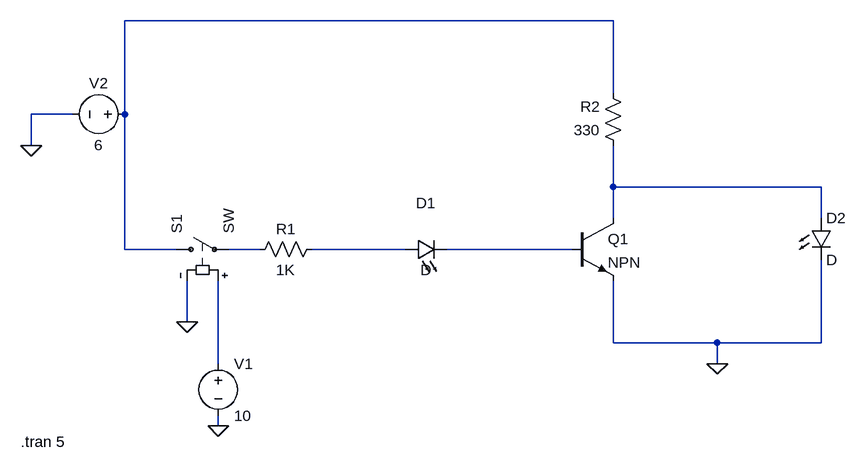
[diagram p0: schematic NOT Gate.asc]
NOT Gate.asc, the LTspice schematic file:
Version 4
SHEET 1 940 680
WIRE 560 -96 -192 -96
WIRE 560 16 560 -96
WIRE -272 48 -336 48
WIRE -192 48 -192 -96
WIRE -336 96 -336 48
WIRE 560 160 560 96
WIRE 880 160 560 160
WIRE 560 208 560 160
WIRE 880 208 880 160
WIRE -192 256 -192 48
WIRE -112 256 -192 256
WIRE 16 256 -32 256
WIRE 240 256 96 256
WIRE 496 256 304 256
WIRE -96 368 -96 304
WIRE 560 400 560 304
WIRE 720 400 560 400
WIRE 880 400 880 272
WIRE 880 400 720 400
WIRE -48 432 -48 304
WIRE 720 432 720 400
WIRE -48 528 -48 512
FLAG 720 432 0
FLAG -96 368 0
FLAG -48 528 0
FLAG -336 96 0
SYMBOL res 112 240 R90
WINDOW 0 0 56 VBottom 2
WINDOW 3 32 56 VTop 2
SYMATTR InstName R1
SYMATTR Value 1K
SYMATTR SpiceLine tol=1 pwr=0.1
SYMBOL res 576 112 R180
WINDOW 0 36 76 Left 2
WINDOW 3 36 40 Left 2
SYMATTR InstName R2
SYMATTR Value 330
SYMBOL npn 496 208 R0
SYMATTR InstName Q1
SYMBOL LED 240 272 R270
WINDOW 0 72 32 VTop 2
WINDOW 3 0 32 VBottom 2
SYMATTR InstName D1
SYMBOL LED 864 208 R0
SYMATTR InstName D2
SYMBOL sw -128 256 R270
SYMATTR InstName S1
SYMBOL voltage -48 416 R0
WINDOW 123 0 0 Left 0
WINDOW 39 0 0 Left 0
SYMATTR InstName V1
SYMATTR Value 10
SYMBOL voltage -176 48 R90
WINDOW 0 -32 56 VBottom 2
WINDOW 3 32 56 VTop 2
WINDOW 123 0 0 Left 0
WINDOW 39 0 0 Left 0
SYMATTR InstName V2
SYMATTR Value 6
TEXT -352 552 Left 2 !.tran 5

The netlist it stands for:
* NOT Gate.asc
R1 N004 N003 1K tol=1 pwr=0.1
R2 N002 N001 330
Q1 N002 N005 0 0 NPN
D1 N004 N005 D
D2 N002 0 D
S1 N001 N003 N006 0 SW
V1 N006 0 10
V2 N001 0 6
.model D D
.lib standard.dio
.model NPN NPN
.model PNP PNP
.lib standard.bjt
.tran 5
.backanno
.end